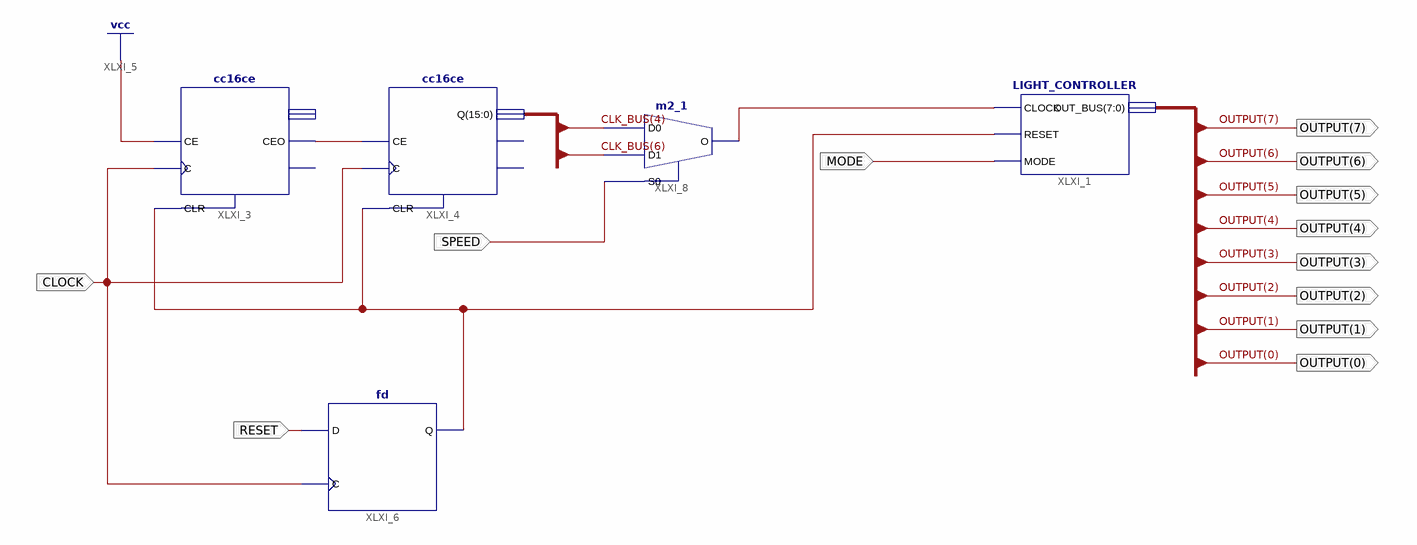
[diagram p0: schematic sheet 1]
// Xilinx ISE schematic TOP_SCHEME.sch (spartan3a) as structural Verilog: 5 symbols, 12 ports
module TOP_SCHEME (
  input  MODE,
  input  CLOCK,
  input  RESET,
  input  SPEED,
  output [7:0] OUTPUT
);

  wire RST, XLXN_12, XLXN_26;
  wire [15:0] CLK_BUS;

  LIGHT_CONTROLLER XLXI_1 (.CLOCK(XLXN_26), .RESET(RST), .MODE(MODE), .OUT_BUS(OUTPUT));
  cc16ce XLXI_3 (.C(CLOCK), .CE(1'b1), .CLR(RST), .CEO(XLXN_12));  // open: Q, TC
  cc16ce XLXI_4 (.C(CLOCK), .CE(XLXN_12), .CLR(RST), .Q(CLK_BUS));  // open: CEO, TC
  fd XLXI_6 (.C(CLOCK), .D(RESET), .Q(RST));
  m2_1 XLXI_8 (.D0(CLK_BUS[4]), .D1(CLK_BUS[6]), .S0(SPEED), .O(XLXN_26));
endmodule
